# Altium schematic sheet Localization MCU.SchDoc
size A4; SPICEModelCacheECBSGNBZ: <root> / <DocumentId>ECBSGNBZ</DocumentId> / <CacheFrame Number="0"> / <Model Name="cap" Kind="MDL"> / <Text>*Default semiconductor capacitor / .MODEL CAP C()</Text> / </Model> / </CacheFrame> / </root>
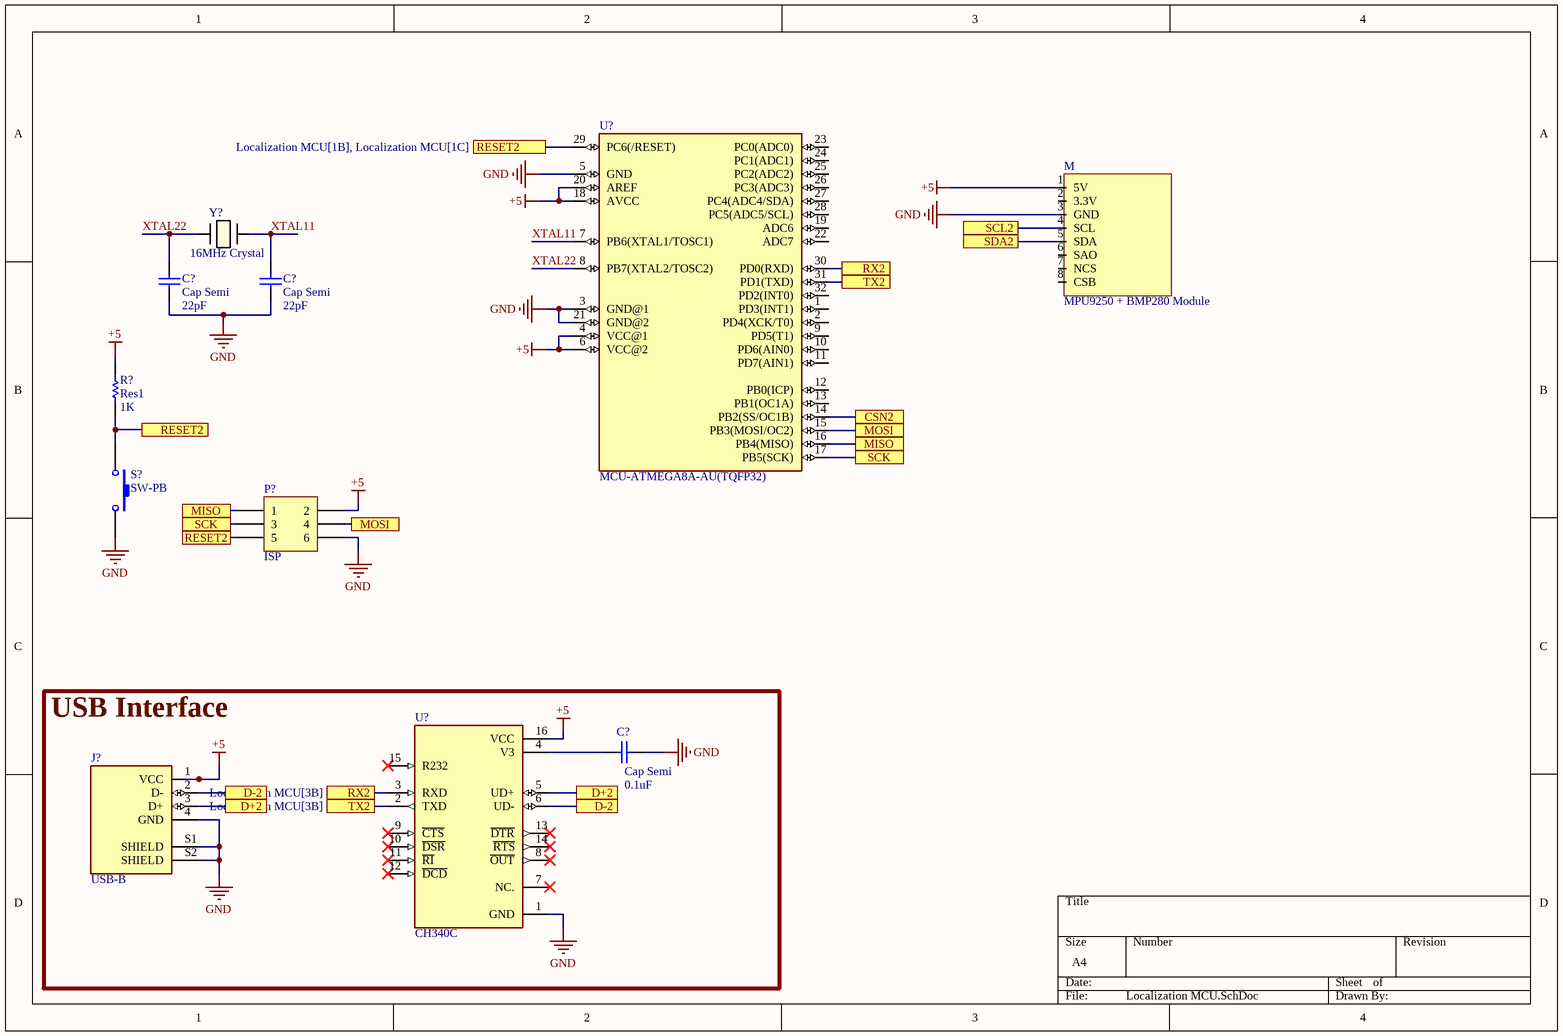
[diagram p0: Localization MCU.SchDoc]

## Parts
(Parts that share a designator on the sheet are numbered #1, #2 ... from top to bottom, then left to right.)
C?#1  Cap Semi  value 22pF  [1608[0603]]
C?#2  Cap Semi  value 22pF  [1608[0603]]
C?#3  Cap Semi  value 0.1uF  [C1206]
J?  USB-B  [SAMTEC_USB-B-S-X-X-TH]
M  MPU9250 + BMP280 Module  [PCBComponent_1]
P?  ISP  [HDR2X3]
R?  Res1  value 1K  [AXIAL-0.3]
S?  SW-PB  [SW_TL3305AF160QG]
U?#1  MCU-ATMEGA8A-AU(TQFP32)  [TQFP32-0.8-7X7MM]
U?#2  CH340C  [SOIC127P600X180-16N]
Y?  16MHz Crystal  [H32_RAM]

## Blocks framed on the sheet
USB Interface: C?#3 J? U?#2

## Ports
CSN2 (see Main MCU[1B]), D+2 (see Localization MCU[1D]), D+2 (see Localization MCU[2D]), D-2 (see Localization MCU[1D]), D-2 (see Localization MCU[2D]), MISO (see Localization MCU[1B], Main MCU[1B], Main MCU[1C], Main MCU[2A]), MISO (see Localization MCU[3B], Main MCU[1B], Main MCU[1C], Main MCU[2A]), MOSI (see Localization MCU[1C], Main MCU[1B], Main MCU[1C], Main MCU[2A]), MOSI (see Localization MCU[3B], Main MCU[1B], Main MCU[1C], Main MCU[2A]), RESET2 (see Localization MCU[1B], Localization MCU[1C]), RESET2 (see Localization MCU[1B], Localization MCU[2A]), RESET2 (see Localization MCU[1C], Localization MCU[2A]), RX2 (see Localization MCU[1D]), RX2 (see Localization MCU[3B]), SCK (see Localization MCU[1C], Main MCU[1B], Main MCU[1C], Main MCU[2A]), SCK (see Localization MCU[3B], Main MCU[1B], Main MCU[1C], Main MCU[2A]), SCL2, SDA2, TX2 (see Localization MCU[1D]), TX2 (see Localization MCU[3B])

## Nets
+5: J?.1(VCC) M.1(5V) P?.2 R?.2 U?#1.4(VCC@1) U?#1.6(VCC@2) U?#1.18(AVCC) U?#1.20(AREF) U?#2.16(VCC)
GND: C?#1.2 C?#2.2 C?#3.2 J?.4(GND) J?.S1(SHIELD) J?.S2(SHIELD) M.3(GND) P?.6 S?.3,4 U?#1.3(GND@1) U?#1.5(GND) U?#1.21(GND@2) U?#2.1(GND)
CSN2: U?#1.14(PB2(SS/OC1B)) ; port CSN2
D+2: J?.3(D+) U?#2.5(UD+) ; port D+2
D-2: J?.2(D-) U?#2.6(UD-) ; port D-2
MISO: P?.1 U?#1.16(PB4(MISO)) ; port MISO
MOSI: P?.4 U?#1.15(PB3(MOSI/OC2)) ; port MOSI
RESET2: P?.5 R?.1 S?.1,2 U?#1.29(PC6(/RESET)) ; port RESET2
RX2: U?#1.30(PD0(RXD)) U?#2.3(RXD) ; port RX2
SCK: P?.3 U?#1.17(PB5(SCK)) ; port SCK
SCL2: M.4(SCL) ; port SCL2
SDA2: M.5(SDA) ; port SDA2
TX2: U?#1.31(PD1(TXD)) U?#2.2(TXD) ; port TX2
XTAL11: C?#2.1 U?#1.7(PB6(XTAL1/TOSC1)) Y?.2
XTAL22: C?#1.1 U?#1.8(PB7(XTAL2/TOSC2)) Y?.1
NetC?#3_1: C?#3.1 U?#2.4(V3)

Not connected (* = marked no-connect by the designer): M 2(3.3V) 6(SAO) 7(NCS) 8(CSB); U?#1 1(PD3(INT1)) 2(PD4(XCK/T0)) 9(PD5(T1)) 10(PD6(AIN0)) 11(PD7(AIN1)) 12(PB0(ICP)) 13(PB1(OC1A)) 19(ADC6) 22(ADC7) 23(PC0(ADC0)) 24(PC1(ADC1)) 25(PC2(ADC2)) 26(PC3(ADC3)) 27(PC4(ADC4/SDA)) 28(PC5(ADC5/SCL)) 32(PD2(INT0)); U?#2 7(NC.)* 8(~{OUT})* 9(~{CTS})* 10(~{DSR})* 11(~{RI})* 12(~{DCD})* 13(~{DTR})* 14(~{RTS})* 15(R232)*

## Library data of the parts
C?#1-C?#3 = Cap Semi: Capacitor (Semiconductor SIM Model); Published: 8-Jun-2000; LatestRevisionDate: 29-May-2009; LatestRevisionNote: IPC-7351 Footprint Added.; PackageReference: C1206; Publisher: Altium Limited; PackageDescription: Chip Capacitor
J? = USB-B-S-X-X-TH: USB-B (USB TYPE-B) USB 2.0 Receptacle Connector 4 Position Through Hole, Right Angle; MP: USB-B-S-S-B-TH; MF: Samtec; Digi-Key_Part_Number: SAM10869-ND; Check_prices: https://www.snapeda.com/parts/USB-B-S-S-B-TH/Samtec+Inc./view-part/?ref=eda; Package: None; SnapEDA_Link: https://www.snapeda.com/parts/USB-B-S-S-B-TH/Samtec+Inc./view-part/?ref=snap; Value: *; Purchase-URL: https://pricing.snapeda.com/search/part/USB-B-S-S-B-TH/?ref=eda
P? = Header 3X2: Header, 3-Pin, Dual row; LatestRevisionDate: 17-Jul-2002; LatestRevisionNote: Re-released for DXP Platform.; Publisher: Altium Limited
R? = Res1: Resistor; Published: 8-Jun-2000; LatestRevisionDate: 17-Jul-2002; LatestRevisionNote: Re-released for DXP Platform.; PackageReference: AXIAL-0.3; Publisher: Altium Limited; PackageDescription: Axial Device, Thru-Hole; 2 Leads; 0.3 in Pin Spacing
S? = SW-PB: Switch; Published: 24-Mar-1999; LatestRevisionDate: 17-Jul-2002; LatestRevisionNote: Re-released for DXP Platform.; PackageReference: SPST-2; Publisher: Altium Limited; PackageDescription: Switch; 2 Leads
U?#1 = MCU-ATMEGA8A-AU(TQFP32): AVR AVRÂ® ATmega Microcontroller IC 8-Bit 16MHz 8KB (4K x 16) FLASH; MF: Microchip; Value: *; Purchase-URL: https://pricing.snapeda.com/search/part/ATMEGA8A-AU/?ref=eda; Check_prices: https://www.snapeda.com/parts/ATMEGA8A-AU/Microchip/view-part/49714/?ref=eda; SnapEDA_Link: https://www.snapeda.com/parts/ATMEGA8A-AU/Microchip/view-part/49714/?ref=snap; Package: TQFP-32 Microchip; Availability: Good; Price: None; MP: ATMEGA8A-AU
U?#2 = CH340C: USB to serial chip CH340; MF: WCH; Price: None; Availability: Not in stock; MP: CH340C; Package: None; SnapEDA_Link: https://www.snapeda.com/parts/CH340C/WCH/view-part/?ref=snap; Check_prices: https://www.snapeda.com/parts/CH340C/WCH/view-part/?ref=eda; Value: *
Y? = HC49/US-10.244MHZ-16PF-30-EXT-SMD-H32-TR: No Description Available; Mfr_Name: Rami Technology; Copyright: Copyright (C) 2023 Ultra Librarian. All rights reserved.; Manufacturer_Part_Number: HC49/US-10.244MHZ-16PF-30-EXT-SMD-H32-TR; RefDes: RefDes; Type: DEV